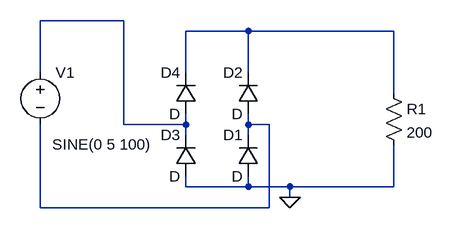
[diagram p0: schematic Yoneda-p88__Full-rectifier.asc]
Yoneda-p88__Full-rectifier.asc, the LTspice schematic file:
Version 4
SHEET 1 880 680
WIRE 16 -48 -112 -48
WIRE 208 -32 112 -32
WIRE 432 -32 208 -32
WIRE -112 32 -112 -48
WIRE 112 32 112 -32
WIRE 208 32 208 -32
WIRE 432 64 432 -32
WIRE 16 112 16 -48
WIRE 112 112 112 96
WIRE 112 112 16 112
WIRE 208 112 208 96
WIRE 240 112 208 112
WIRE 112 128 112 112
WIRE 208 128 208 112
WIRE 112 208 112 192
WIRE 208 208 208 192
WIRE 208 208 112 208
WIRE 272 208 208 208
WIRE 432 208 432 144
WIRE 432 208 272 208
WIRE 272 224 272 208
WIRE -112 240 -112 112
WIRE 240 240 240 112
WIRE 240 240 -112 240
FLAG 272 224 0
SYMBOL diode 224 192 R180
WINDOW 0 24 64 Left 2
WINDOW 3 24 0 Left 2
SYMATTR InstName D1
SYMBOL diode 224 96 R180
WINDOW 0 24 64 Left 2
WINDOW 3 24 0 Left 2
SYMATTR InstName D2
SYMBOL diode 128 192 R180
WINDOW 0 24 64 Left 2
WINDOW 3 24 0 Left 2
SYMATTR InstName D3
SYMBOL diode 128 96 R180
WINDOW 0 24 64 Left 2
WINDOW 3 24 0 Left 2
SYMATTR InstName D4
SYMBOL res 416 48 R0
SYMATTR InstName R1
SYMATTR Value 200
SYMBOL voltage -112 16 R0
WINDOW 3 18 127 Left 2
WINDOW 123 0 0 Left 2
WINDOW 39 0 0 Left 2
SYMATTR InstName V1
SYMATTR Value SINE(0 5 100)

The netlist it stands for:
* Yoneda-p88__Full-rectifier.asc
D1 0 N003 D
D2 N003 N002 D
D3 0 N001 D
D4 N001 N002 D
R1 N002 0 200
V1 N001 N003 SINE(0 5 100)
.model D D
.lib standard.dio
.backanno
.end